# EAGLE schematic Bartosz.Nowakowski (EAGLE 9.6.0)
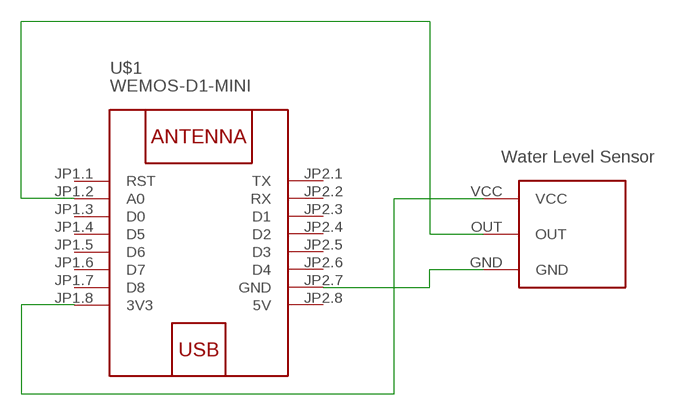
[diagram p0: schematic, sheet 1]

## Parts
U$1  WEMOS-D1-MINI  [WEMOS-D1-MINI]
WATER1  WATERLEVELSENORDEV  [WATERLEVELSENSORFT]

## Nets
N$1: U$1.JP1.2(A0) WATER1.OUT
N$2: U$1.JP1.8(3V3) WATER1.VCC
N$3: U$1.JP2.7(GND) WATER1.GND
Unconnected: U$1.JP1.1(RST) U$1.JP1.3(D0) U$1.JP1.4(D5) U$1.JP1.5(D6) U$1.JP1.6(D7) U$1.JP1.7(D8) U$1.JP2.1(TX) U$1.JP2.2(RX) U$1.JP2.3(D1) U$1.JP2.4(D2) U$1.JP2.5(D3) U$1.JP2.6(D4)

## Power pins joined to a net without a drawn wire
5V: U$1.JP2.8(5V)

## Library data of the parts
U$1 = diy-modules:WEMOS-D1-MINI: WEMOS D1 mini: Mini Wi-Fi Board based on ESP-8266 device More details can be found here: https://www.wemos.cc/product/d1-mini.html Click here to find device on ebay.com <http://www.ebay.com/sch/wemos+d1+mini+nodemcu>
WATER1 = WaterLevel:WATERLEVELSENORDEV